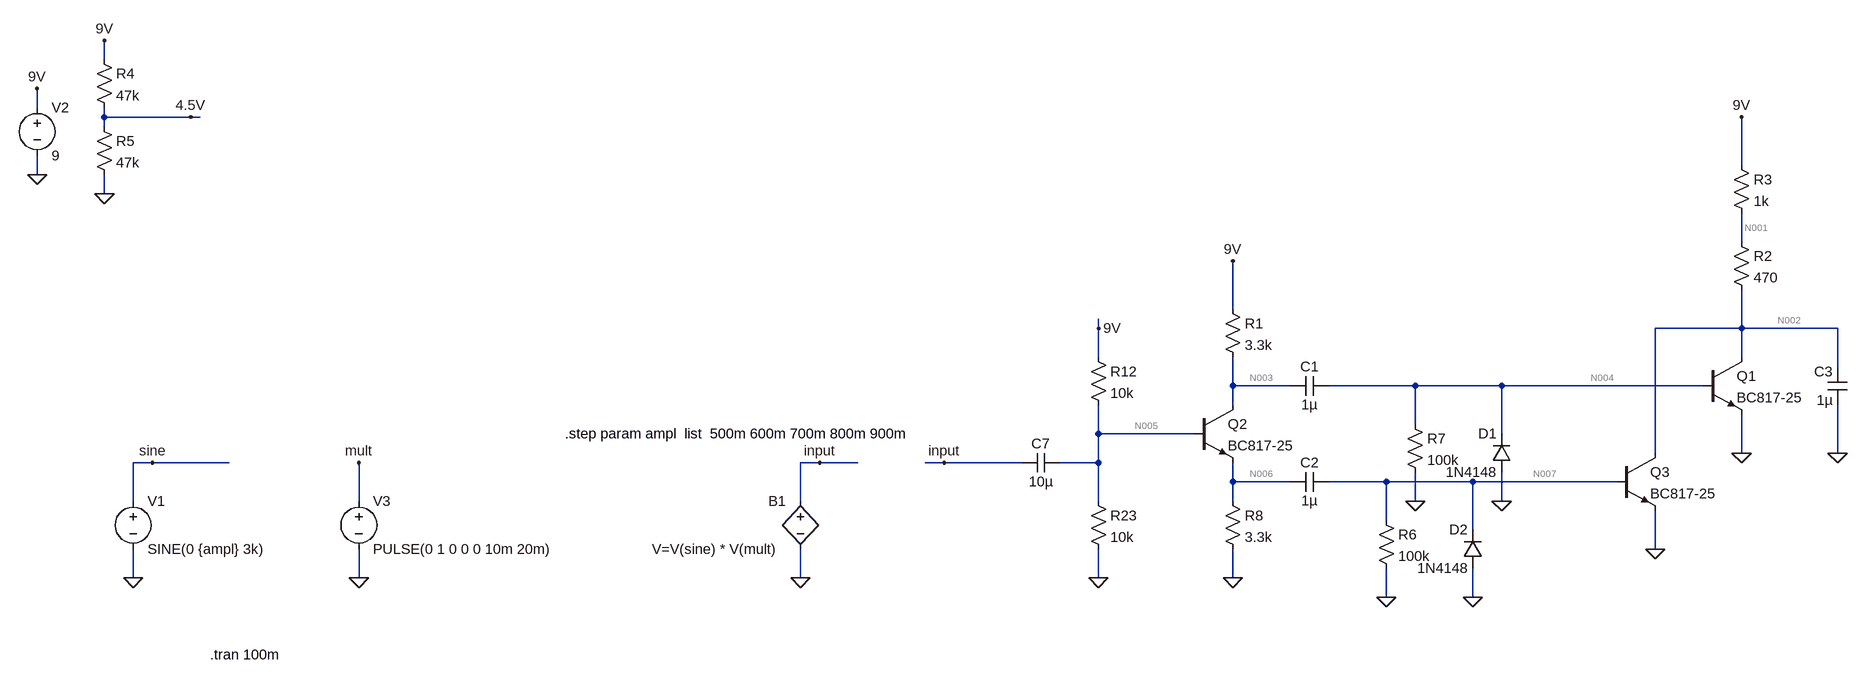
[diagram p0: schematic bjt_peak_detect.asc]
bjt_peak_detect.asc, the LTspice schematic file:
Version 4
SHEET 1 4932 2004
WIRE -656 -464 -656 -496
WIRE -768 -384 -768 -416
WIRE -656 -368 -656 -384
WIRE -512 -368 -656 -368
WIRE -496 -368 -512 -368
WIRE -656 -352 -656 -368
WIRE 2400 -288 2400 -368
WIRE -768 -272 -768 -304
WIRE -656 -240 -656 -272
WIRE 2400 -160 2400 -208
WIRE 1552 -48 1552 -128
WIRE 1328 -16 1328 -32
WIRE 2400 -16 2400 -80
WIRE 2400 -16 2256 -16
WIRE 2560 -16 2400 -16
WIRE 1328 32 1328 -16
WIRE 2400 32 2400 -16
WIRE 2560 48 2560 -16
WIRE 1552 80 1552 32
WIRE 1648 80 1552 80
WIRE 1856 80 1712 80
WIRE 2000 80 1856 80
WIRE 2336 80 2000 80
WIRE 1552 112 1552 80
WIRE 1856 144 1856 80
WIRE 1328 160 1328 112
WIRE 1488 160 1328 160
WIRE 2000 160 2000 80
WIRE 2256 192 2256 -16
WIRE 2400 192 2400 128
WIRE 2560 192 2560 112
WIRE -576 208 -608 208
WIRE -448 208 -576 208
WIRE 848 208 816 208
WIRE 912 208 848 208
WIRE 1056 208 1024 208
WIRE 1200 208 1056 208
WIRE 1328 208 1328 160
WIRE 1328 208 1264 208
WIRE 1552 240 1552 208
WIRE 1648 240 1552 240
WIRE 1808 240 1712 240
WIRE 1952 240 1808 240
WIRE 2192 240 1952 240
WIRE -608 272 -608 208
WIRE 80 272 80 208
WIRE 816 272 816 208
WIRE 1328 272 1328 208
WIRE 1552 272 1552 240
WIRE 1856 272 1856 224
WIRE 2000 272 2000 224
WIRE 1808 304 1808 240
WIRE 1952 320 1952 240
WIRE 2256 352 2256 288
WIRE -608 400 -608 352
WIRE 80 400 80 352
WIRE 816 400 816 352
WIRE 1328 400 1328 352
WIRE 1552 400 1552 352
WIRE 1808 432 1808 384
WIRE 1952 432 1952 384
FLAG -768 -416 9V
FLAG -768 -272 0
FLAG -656 -496 9V
FLAG -656 -240 0
FLAG -512 -368 4.5V
FLAG -608 400 0
FLAG 80 400 0
FLAG 80 208 mult
FLAG 816 400 0
FLAG -576 208 sine
FLAG 848 208 input
FLAG 1056 208 input
FLAG 1552 400 0
FLAG 1552 -128 9V
FLAG 1328 400 0
FLAG 1328 -16 9V
FLAG 2256 352 0
FLAG 2400 192 0
FLAG 2560 192 0
FLAG 2400 -368 9V
FLAG 1808 432 0
FLAG 1856 272 0
FLAG 2000 272 0
FLAG 1952 432 0
SYMBOL voltage -608 256 R0
WINDOW 123 0 0 Left 0
WINDOW 39 0 0 Left 0
SYMATTR InstName V1
SYMATTR Value SINE(0 {ampl} 3k)
SYMBOL voltage -768 -400 R0
WINDOW 123 0 0 Left 0
WINDOW 39 0 0 Left 0
SYMATTR InstName V2
SYMATTR Value 9
SYMBOL res -672 -480 R0
SYMATTR InstName R4
SYMATTR Value 47k
SYMBOL res -672 -368 R0
SYMATTR InstName R5
SYMATTR Value 47k
SYMBOL voltage 80 256 R0
WINDOW 123 0 0 Left 0
WINDOW 39 0 0 Left 0
SYMATTR InstName V3
SYMATTR Value PULSE(0 1 0 0 0 10m 20m)
SYMBOL bv 816 256 M0
WINDOW 3 40 96 Left 2
SYMATTR Value V=V(sine) * V(mult)
SYMATTR InstName B1
SYMBOL cap 1264 192 R90
WINDOW 0 0 32 VBottom 2
WINDOW 3 32 32 VTop 2
SYMATTR InstName C7
SYMATTR Value 10µ
SYMBOL res 1312 256 R0
SYMATTR InstName R23
SYMATTR Value 10k
SYMBOL npn 1488 112 R0
SYMATTR InstName Q2
SYMATTR Value BC817-25
SYMBOL res 1536 256 R0
SYMATTR InstName R8
SYMATTR Value 3.3k
SYMBOL res 1312 16 R0
SYMATTR InstName R12
SYMATTR Value 10k
SYMBOL npn 2192 192 R0
SYMATTR InstName Q3
SYMATTR Value BC817-25
SYMBOL res 1536 -64 R0
SYMATTR InstName R1
SYMATTR Value 3.3k
SYMBOL cap 1712 64 R90
WINDOW 0 0 32 VBottom 2
WINDOW 3 32 32 VTop 2
SYMATTR InstName C1
SYMATTR Value 1µ
SYMBOL cap 1712 224 R90
WINDOW 0 0 32 VBottom 2
WINDOW 3 32 32 VTop 2
SYMATTR InstName C2
SYMATTR Value 1µ
SYMBOL npn 2336 32 R0
SYMATTR InstName Q1
SYMATTR Value BC817-25
SYMBOL res 2384 -176 R0
SYMATTR InstName R2
SYMATTR Value 470
SYMBOL cap 2576 112 R180
WINDOW 0 24 56 Left 2
WINDOW 3 24 8 Left 2
SYMATTR InstName C3
SYMATTR Value 1µ
SYMBOL res 2384 -304 R0
SYMATTR InstName R3
SYMATTR Value 1k
SYMBOL res 1792 288 R0
SYMATTR InstName R6
SYMATTR Value 100k
SYMBOL res 1840 128 R0
SYMATTR InstName R7
SYMATTR Value 100k
SYMBOL diode 2016 224 R180
WINDOW 0 24 64 Left 2
WINDOW 3 24 0 Left 2
SYMATTR InstName D1
SYMATTR Value 1N4148
SYMBOL diode 1968 384 R180
WINDOW 0 24 64 Left 2
WINDOW 3 24 0 Left 2
SYMATTR InstName D2
SYMATTR Value 1N4148
TEXT -480 528 Left 2 !.tran 100m
TEXT 424 160 Left 2 !.step param ampl  list  500m 600m 700m 800m 900m

The netlist it stands for:
* bjt_peak_detect.asc
V1 sine 0 SINE(0 {ampl} 3k)
V2 9V 0 9
R4 9V 4.5V 47k
R5 4.5V 0 47k
V3 mult 0 PULSE(0 1 0 0 0 10m 20m)
B1 input 0 V=V(sine) * V(mult)
C7 N005 input 10µ
R23 N005 0 10k
Q2 N003 N005 N006 0 BC817-25
R8 N006 0 3.3k
R12 9V N005 10k
Q3 N002 N007 0 0 BC817-25
R1 9V N003 3.3k
C1 N004 N003 1µ
C2 N007 N006 1µ
Q1 N002 N004 0 0 BC817-25
R2 N001 N002 470
C3 0 N002 1µ
R3 9V N001 1k
R6 N007 0 100k
R7 N004 0 100k
D1 0 N004 1N4148
D2 0 N007 1N4148
.model D D
.lib standard.dio
.model NPN NPN
.model PNP PNP
.lib standard.bjt
.tran 100m
.step param ampl  list  500m 600m 700m 800m 900m
.backanno
.end

* Results of the author's LTspice run, read from the files saved beside the schematic
* Operating Point (first step), zero values left out:
*   ampl = 500 m
*   V(9v) = 9 V
*   V(4.5v) = 4.5 V
*   V(n005) = 4.482 V
*   V(n003) = 5.134 V
*   V(n006) = 3.878 V
*   V(n002) = 9 V
*   V(n007) = 895.8 nV
*   V(n004) = 895.8 nV
*   V(n001) = 9 V
*   Ic(Q1) = 9.118 pA
*   Ib(Q1) = -9.008 pA
*   Ic(Q3) = 9.118 pA
*   Ib(Q3) = -9.008 pA
*   Ic(Q2) = 1.172 mA
*   Ib(Q2) = 3.531 µA
*   Ie(Q2) = -1.175 mA
*   I(R7) = 8.958 pA
*   I(R6) = 8.958 pA
*   I(R3) = 18.23 pA
*   I(R2) = 18.23 pA
*   I(R1) = 1.172 mA
*   I(R12) = 451.8 µA
*   I(R8) = 1.175 mA
*   I(R23) = 448.2 µA
*   I(R5) = 95.74 µA
*   I(R4) = 95.74 µA
*   I(V2) = -1.719 mA